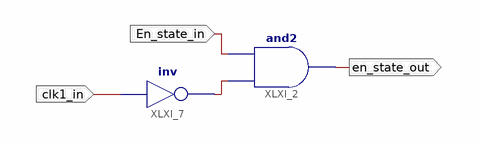
[diagram p0: schematic sheet 1]
// Xilinx ISE schematic snaggle_rx.sch (spartan3e) as structural Verilog: 2 symbols, 3 ports
module snaggle_rx (
  input  clk1_in,
  input  En_state_in,
  output en_state_out
);

  wire XLXN_3;

  and XLXI_2 (en_state_out, XLXN_3, En_state_in);
  not XLXI_7 (XLXN_3, clk1_in);
endmodule
